# Altium schematic sheet Schemtaic Sheet 1.SchDoc
size A4; SheetNumber: 4; SheetTotal: 3
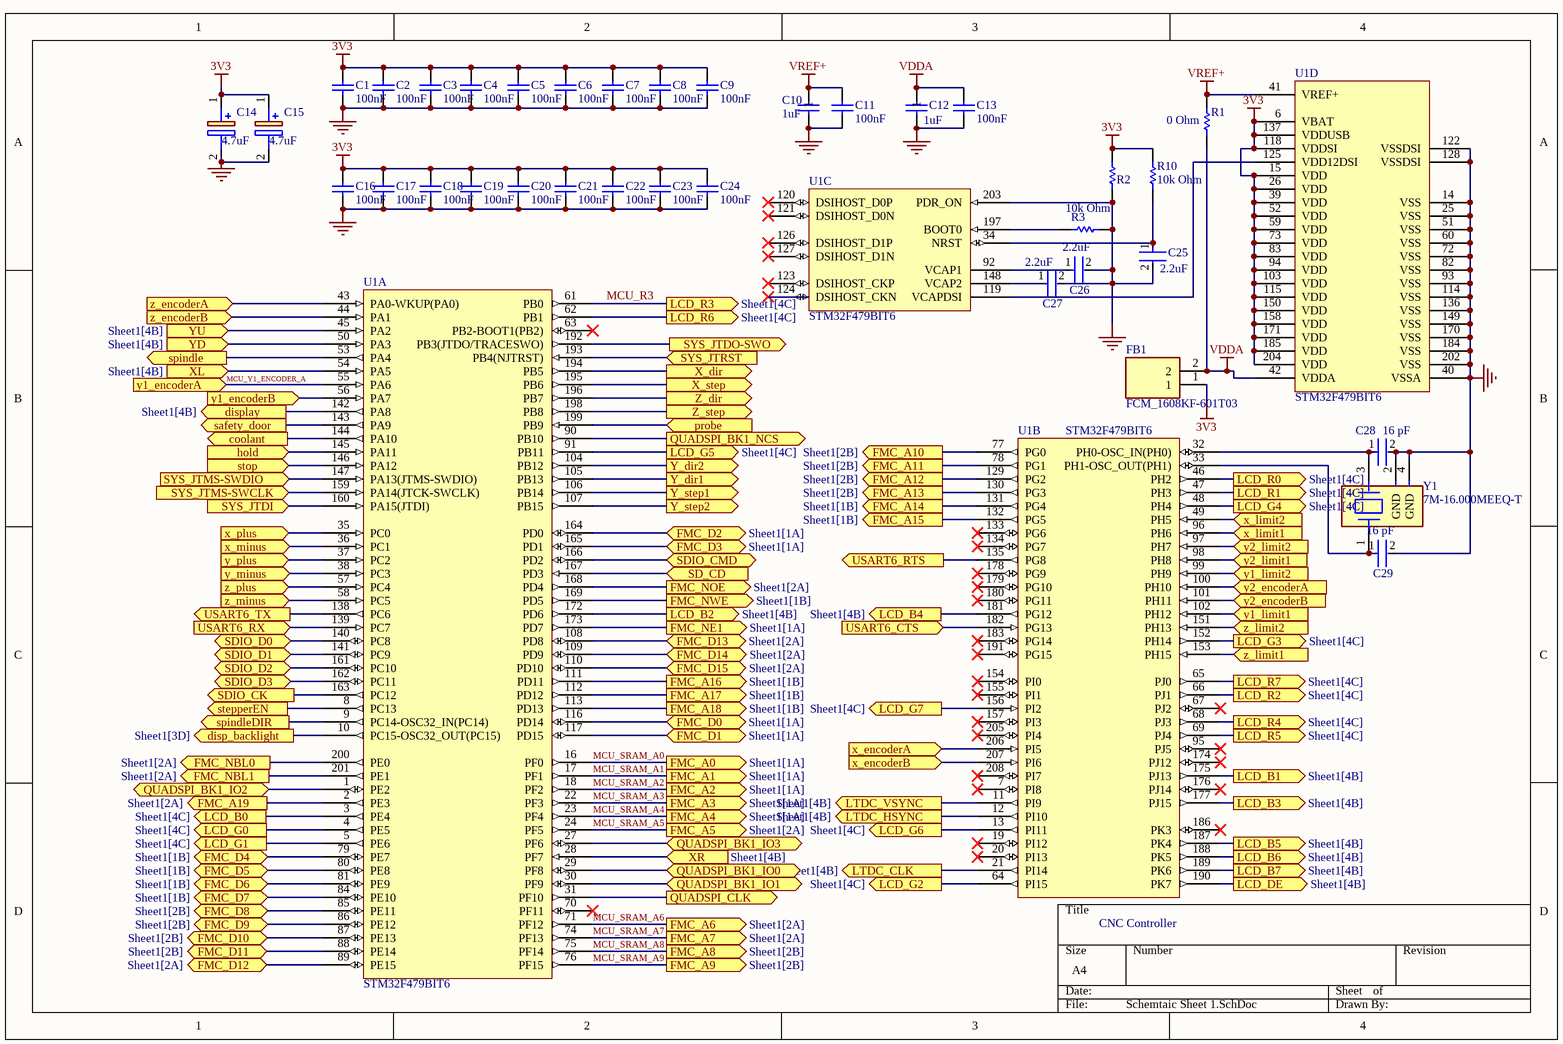
[diagram p0: Schemtaic Sheet 1.SchDoc]

## Parts
C1  Capacitance: 100nF  [CAPC1050X55X23ML05T13]  (hidden comment: CL05B104KO5NNNC)
C2  Capacitance: 100nF  [CAPC1050X55X23ML05T13]  (hidden comment: CL05B104KO5NNNC)
C3  Capacitance: 100nF  [CAPC1050X55X23ML05T13]  (hidden comment: CL05B104KO5NNNC)
C4  Capacitance: 100nF  [CAPC1050X55X23ML05T13]  (hidden comment: CL05B104KO5NNNC)
C5  Capacitance: 100nF  [CAPC1050X55X23ML05T13]  (hidden comment: CL05B104KO5NNNC)
C6  Capacitance: 100nF  [CAPC1050X55X23ML05T13]  (hidden comment: CL05B104KO5NNNC)
C7  Capacitance: 100nF  [CAPC1050X55X23ML05T13]  (hidden comment: CL05B104KO5NNNC)
C8  Capacitance: 100nF  [CAPC1050X55X23ML05T13]  (hidden comment: CL05B104KO5NNNC)
C9  Capacitance: 100nF  [CAPC1050X55X23ML05T13]  (hidden comment: CL05B104KO5NNNC)
C10  Capacitance: 1uF  [CAPC1609X100X15LL20]  (hidden comment: TACL105K016XTA)
C11  Capacitance: 100nF  [CAPC1050X55X23ML05T13]  (hidden comment: CL05B104KO5NNNC)
C12  Capacitance: 1uF  [CAPC1609X100X15LL20]  (hidden comment: TACL105K016XTA)
C13  Capacitance: 100nF  [CAPC1050X55X23ML05T13]  (hidden comment: CL05B104KO5NNNC)
C14  Capacitance: 4.7uF  [CAPPM169X100N]  (hidden comment: F981C475MMAAJ6)
C15  Capacitance: 4.7uF  [CAPPM169X100N]  (hidden comment: F981C475MMAAJ6)
C16  Capacitance: 100nF  [CAPC1050X55X23ML05T13]  (hidden comment: CL05B104KO5NNNC)
C17  Capacitance: 100nF  [CAPC1050X55X23ML05T13]  (hidden comment: CL05B104KO5NNNC)
C18  Capacitance: 100nF  [CAPC1050X55X23ML05T13]  (hidden comment: CL05B104KO5NNNC)
C19  Capacitance: 100nF  [CAPC1050X55X23ML05T13]  (hidden comment: CL05B104KO5NNNC)
C20  Capacitance: 100nF  [CAPC1050X55X23ML05T13]  (hidden comment: CL05B104KO5NNNC)
C21  Capacitance: 100nF  [CAPC1050X55X23ML05T13]  (hidden comment: CL05B104KO5NNNC)
C22  Capacitance: 100nF  [CAPC1050X55X23ML05T13]  (hidden comment: CL05B104KO5NNNC)
C23  Capacitance: 100nF  [CAPC1050X55X23ML05T13]  (hidden comment: CL05B104KO5NNNC)
C24  Capacitance: 100nF  [CAPC1050X55X23ML05T13]  (hidden comment: CL05B104KO5NNNC)
C25  Capacitance: 2.2uF  [FP-0603-L_1_6_0_15-W_0_81-IPC_C]  (hidden comment: 0603YC225KAT2A)
C26  Capacitance: 2.2uF  [FP-0603-L_1_6_0_15-W_0_81-IPC_C]  (hidden comment: 0603YC225KAT2A)
C27  Capacitance: 2.2uF  [FP-0603-L_1_6_0_15-W_0_81-IPC_C]  (hidden comment: 0603YC225KAT2A)
C28  Capacitance: 16 pF  [FP-C0402-BB-MFG]  (hidden comment: C0402C160F4HACTU)
C29  value 16 pF  [FP-C0402-BB-MFG]  (hidden comment: C0402C160F4HACTU)
FB1  FCM_1608KF-601T03  [BEADC1608X95N]
R1  Resistance: 0 Ohm  [RESC1005X40X25ML05T10]  (hidden comment: CRCW04020000Z0EDHP)
R2  CRCW040210K0FKEDHP  [RESC1005X40X25ML05T10]  (value not drawn)
R3  Resistance: 10k Ohm  [RESC1005X40X25ML05T10]  (hidden comment: CRCW040210K0FKEDHP)
R10  Resistance: 10k Ohm  [RESC1005X40X25ML05T10]  (hidden comment: CRCW040210K0FKEDHP)
U1  STM32F479BIT6  [STM-LQFP208_L]  (parts A,B,C,D of 4)
Y1  7M-16.000MEEQ-T  [FP-7M-MFG]

## Ports
coolant (out), disp_backlight (out, see Sheet1[3D]), display (out, see Sheet1[4B]), FMC_A0 (out, see Sheet1[1A]), FMC_A1 (out, see Sheet1[1A]), FMC_A2 (out, see Sheet1[1A]), FMC_A3 (out, see Sheet1[1A]), FMC_A4 (out, see Sheet1[1A]), FMC_A5 (out, see Sheet1[2A]), FMC_A6 (out, see Sheet1[2A]), FMC_A7 (out, see Sheet1[2A]), FMC_A8 (out, see Sheet1[2B]), FMC_A9 (out, see Sheet1[2B]), FMC_A10 (out, see Sheet1[2B]), FMC_A11 (out, see Sheet1[2B]), FMC_A12 (out, see Sheet1[2B]), FMC_A13 (out, see Sheet1[2B]), FMC_A14 (out, see Sheet1[1B]), FMC_A15 (out, see Sheet1[1B]), FMC_A16 (out, see Sheet1[1B]), FMC_A17 (out, see Sheet1[1B]), FMC_A18 (out, see Sheet1[1B]), FMC_A19 (out, see Sheet1[2A]), FMC_D0 (bidir, see Sheet1[1A]), FMC_D1 (bidir, see Sheet1[1A]), FMC_D2 (bidir, see Sheet1[1A]), FMC_D3 (bidir, see Sheet1[1A]), FMC_D4 (bidir, see Sheet1[1B]), FMC_D5 (bidir, see Sheet1[1B]), FMC_D6 (bidir, see Sheet1[1B]), FMC_D7 (bidir, see Sheet1[1B]), FMC_D8 (bidir, see Sheet1[2B]), FMC_D9 (bidir, see Sheet1[2B]), FMC_D10 (bidir, see Sheet1[2B]), FMC_D11 (bidir, see Sheet1[2B]), FMC_D12 (bidir, see Sheet1[2A]), FMC_D13 (bidir, see Sheet1[2A]), FMC_D14 (bidir, see Sheet1[2A]), FMC_D15 (bidir, see Sheet1[2A]), FMC_NBL0 (out, see Sheet1[2A]), FMC_NBL1 (out, see Sheet1[2A]), FMC_NE1 (out, see Sheet1[1A]), FMC_NOE (out, see Sheet1[2A]), FMC_NWE (out, see Sheet1[1B]), hold (in), LCD_B0 (out, see Sheet1[4C]), LCD_B1 (out, see Sheet1[4B]), LCD_B2 (out, see Sheet1[4B]), LCD_B3 (out, see Sheet1[4B]), LCD_B4 (out, see Sheet1[4B]), LCD_B5 (out, see Sheet1[4B]), LCD_B6 (out, see Sheet1[4B]), LCD_B7 (out, see Sheet1[4B]), LCD_DE (out, see Sheet1[4B]), LCD_G0 (out, see Sheet1[4C]), LCD_G1 (out, see Sheet1[4C]), LCD_G2 (out, see Sheet1[4C]), LCD_G3 (out, see Sheet1[4C]), LCD_G4 (out, see Sheet1[4C]), LCD_G5 (out, see Sheet1[4C]), LCD_G6 (out, see Sheet1[4C]), LCD_G7 (out, see Sheet1[4C]), LCD_R0 (out, see Sheet1[4C]), LCD_R1 (out, see Sheet1[4C]), LCD_R2 (out, see Sheet1[4C]), LCD_R3 (out, see Sheet1[4C]), LCD_R4 (out, see Sheet1[4C]), LCD_R5 (out, see Sheet1[4C]), LCD_R6 (out, see Sheet1[4C]), LCD_R7 (out, see Sheet1[4C]), LTDC_CLK (out, see Sheet1[4B]), LTDC_HSYNC (out, see Sheet1[4B]), LTDC_VSYNC (out, see Sheet1[4B]), probe (in), QUADSPI_BK1_IO0 (bidir), QUADSPI_BK1_IO1 (bidir), QUADSPI_BK1_IO2 (bidir), QUADSPI_BK1_IO3 (bidir), QUADSPI_BK1_NCS (out), QUADSPI_CLK (out), safety_door (out), SD_CD (in), SDIO_CK (out), SDIO_CMD (bidir), SDIO_D0 (bidir), SDIO_D1 (bidir), SDIO_D2 (bidir), SDIO_D3 (bidir), spindle (out), spindleDIR (out), stepperEN (out), stop (in), SYS_JTDI (in), SYS_JTDO-SWO (out), SYS_JTMS-SWCLK (in), SYS_JTMS-SWDIO (in), SYS_JTRST (in), USART6_CTS (in), USART6_RTS (out), USART6_RX (in), USART6_TX (out), X_dir (out), x_encoderA (in), x_encoderB (in), x_limit1 (in), x_limit2 (in), x_minus (in), x_plus (in), X_step (out), XL (in, see Sheet1[4B]), XR (in, see Sheet1[4B]), y1_encoderA (in), y1_encoderB (in), y1_limit1 (in), y1_limit2 (in), y2_encoderA (in), y2_encoderB (in), y2_limit1 (in), y2_limit2 (in), Y_dir1 (out), Y_dir2 (out), y_minus (in), y_plus (in), Y_step1 (out), Y_step2 (out), YD (in, see Sheet1[4B]), YU (in, see Sheet1[4B]), Z_dir (out), z_encoderA (in), z_encoderB (in), z_limit1 (in), z_limit2 (in), z_minus (in), z_plus (in), Z_step (out)

## Nets
3V3: C1.2 C2.2 C3.2 C4.2 C5.2 C6.2 C7.2 C8.2 C9.2 C14.1(+) C15.1(+) C16.2 C17.2 C18.2 C19.2 C20.2 C21.2 C22.2 C23.2 C24.2 FB1.1 R2.2 R10.2 U1.6(VBAT) U1.15(VDD) U1.26(VDD) U1.39(VDD) U1.52(VDD) U1.59(VDD) U1.73(VDD) U1.83(VDD) U1.94(VDD) U1.103(VDD) U1.115(VDD) U1.118(VDDSI) U1.137(VDDUSB) U1.150(VDD) U1.158(VDD) U1.171(VDD) U1.185(VDD) U1.204(VDD)
GND: C1.1 C2.1 C3.1 C4.1 C5.1 C6.1 C7.1 C8.1 C9.1 C10.1 C11.1 C12.1 C13.1 C14.2(-) C15.2(-) C16.1 C17.1 C18.1 C19.1 C20.1 C21.1 C22.1 C23.1 C24.1 C25.2 C26.2 C27.2 C28.2 C29.2 R2.1 R3.2 U1.14(VSS) U1.25(VSS) U1.40(VSSA) U1.51(VSS) U1.60(VSS) U1.72(VSS) U1.82(VSS) U1.93(VSS) U1.114(VSS) U1.122(VSSDSI) U1.128(VSSDSI) U1.136(VSS) U1.149(VSS) U1.170(VSS) U1.184(VSS) U1.202(VSS) U1.203(PDR_ON) Y1.2(GND) Y1.4(GND)
VDDA: C12.2 C13.2 FB1.2 R1.1 U1.42(VDDA)
VREF+: C10.2 C11.2 R1.2 U1.41(VREF+)
coolant: U1.144(PA10) ; port coolant
disp_backlight: U1.10(PC15-OSC32_OUT(PC15)) ; port disp_backlight
display: U1.142(PA8) ; port display
FMC_A10: U1.77(PG0) ; port FMC_A10
FMC_A11: U1.78(PG1) ; port FMC_A11
FMC_A12: U1.129(PG2) ; port FMC_A12
FMC_A13: U1.130(PG3) ; port FMC_A13
FMC_A14: U1.131(PG4) ; port FMC_A14
FMC_A15: U1.132(PG5) ; port FMC_A15
FMC_A16: U1.111(PD11) ; port FMC_A16
FMC_A17: U1.112(PD12) ; port FMC_A17
FMC_A18: U1.113(PD13) ; port FMC_A18
FMC_A19: U1.2(PE3) ; port FMC_A19
FMC_D0: U1.116(PD14) ; port FMC_D0
FMC_D1: U1.117(PD15) ; port FMC_D1
FMC_D2: U1.164(PD0) ; port FMC_D2
FMC_D3: U1.165(PD1) ; port FMC_D3
FMC_D4: U1.79(PE7) ; port FMC_D4
FMC_D5: U1.80(PE8) ; port FMC_D5
FMC_D6: U1.81(PE9) ; port FMC_D6
FMC_D7: U1.84(PE10) ; port FMC_D7
FMC_D8: U1.85(PE11) ; port FMC_D8
FMC_D9: U1.86(PE12) ; port FMC_D9
FMC_D10: U1.87(PE13) ; port FMC_D10
FMC_D11: U1.88(PE14) ; port FMC_D11
FMC_D12: U1.89(PE15) ; port FMC_D12
FMC_D13: U1.108(PD8) ; port FMC_D13
FMC_D14: U1.109(PD9) ; port FMC_D14
FMC_D15: U1.110(PD10) ; port FMC_D15
FMC_NBL0: U1.200(PE0) ; port FMC_NBL0
FMC_NBL1: U1.201(PE1) ; port FMC_NBL1
FMC_NE1: U1.173(PD7) ; port FMC_NE1
FMC_NOE: U1.168(PD4) ; port FMC_NOE
FMC_NWE: U1.169(PD5) ; port FMC_NWE
hold: U1.145(PA11) ; port hold
LCD_B0: U1.3(PE4) ; port LCD_B0
LCD_B1: U1.175(PJ13) ; port LCD_B1
LCD_B2: U1.172(PD6) ; port LCD_B2
LCD_B3: U1.177(PJ15) ; port LCD_B3
LCD_B4: U1.181(PG12) ; port LCD_B4
LCD_B5: U1.187(PK4) ; port LCD_B5
LCD_B6: U1.188(PK5) ; port LCD_B6
LCD_B7: U1.189(PK6) ; port LCD_B7
LCD_DE: U1.190(PK7) ; port LCD_DE
LCD_G0: U1.4(PE5) ; port LCD_G0
LCD_G1: U1.5(PE6) ; port LCD_G1
LCD_G2: U1.64(PI15) ; port LCD_G2
LCD_G3: U1.152(PH14) ; port LCD_G3
LCD_G4: U1.48(PH4) ; port LCD_G4
LCD_G5: U1.91(PB11) ; port LCD_G5
LCD_G6: U1.13(PI11) ; port LCD_G6
LCD_G7: U1.156(PI2) ; port LCD_G7
LCD_R0: U1.46(PH2) ; port LCD_R0
LCD_R1: U1.47(PH3) ; port LCD_R1
LCD_R2: U1.66(PJ1) ; port LCD_R2
LCD_R4: U1.68(PJ3) ; port LCD_R4
LCD_R5: U1.69(PJ4) ; port LCD_R5
LCD_R6: U1.62(PB1) ; port LCD_R6
LCD_R7: U1.65(PJ0) ; port LCD_R7
LTDC_CLK: U1.21(PI14) ; port LTDC_CLK
LTDC_HSYNC: U1.12(PI10) ; port LTDC_HSYNC
LTDC_VSYNC: U1.11(PI9) ; port LTDC_VSYNC
MCU_R3: U1.61(PB0) ; port LCD_R3
MCU_SRAM_A0: U1.16(PF0) ; port FMC_A0
MCU_SRAM_A1: U1.17(PF1) ; port FMC_A1
MCU_SRAM_A2: U1.18(PF2) ; port FMC_A2
MCU_SRAM_A3: U1.22(PF3) ; port FMC_A3
MCU_SRAM_A4: U1.23(PF4) ; port FMC_A4
MCU_SRAM_A5: U1.24(PF5) ; port FMC_A5
MCU_SRAM_A6: U1.71(PF12) ; port FMC_A6
MCU_SRAM_A7: U1.74(PF13) ; port FMC_A7
MCU_SRAM_A8: U1.75(PF14) ; port FMC_A8
MCU_SRAM_A9: U1.76(PF15) ; port FMC_A9
MCU_Y1_ENCODER_A: U1.55(PA6) ; port y1_encoderA
probe: U1.199(PB9) ; port probe
QUADSPI_BK1_IO0: U1.29(PF8) ; port QUADSPI_BK1_IO0
QUADSPI_BK1_IO1: U1.30(PF9) ; port QUADSPI_BK1_IO1
QUADSPI_BK1_IO2: U1.1(PE2) ; port QUADSPI_BK1_IO2
QUADSPI_BK1_IO3: U1.27(PF6) ; port QUADSPI_BK1_IO3
QUADSPI_BK1_NCS: U1.90(PB10) ; port QUADSPI_BK1_NCS
QUADSPI_CLK: U1.31(PF10) ; port QUADSPI_CLK
safety_door: U1.143(PA9) ; port safety_door
SD_CD: U1.167(PD3) ; port SD_CD
SDIO_CK: U1.163(PC12) ; port SDIO_CK
SDIO_CMD: U1.166(PD2) ; port SDIO_CMD
SDIO_D0: U1.140(PC8) ; port SDIO_D0
SDIO_D1: U1.141(PC9) ; port SDIO_D1
SDIO_D2: U1.161(PC10) ; port SDIO_D2
SDIO_D3: U1.162(PC11) ; port SDIO_D3
spindle: U1.53(PA4) ; port spindle
spindleDIR: U1.9(PC14-OSC32_IN(PC14)) ; port spindleDIR
stepperEN: U1.8(PC13) ; port stepperEN
stop: U1.146(PA12) ; port stop
SYS_JTDI: U1.160(PA15(JTDI)) ; port SYS_JTDI
SYS_JTDO-SWO: U1.192(PB3(JTDO/TRACESWO)) ; port SYS_JTDO-SWO
SYS_JTMS-SWCLK: U1.159(PA14(JTCK-SWCLK)) ; port SYS_JTMS-SWCLK
SYS_JTMS-SWDIO: U1.147(PA13(JTMS-SWDIO)) ; port SYS_JTMS-SWDIO
SYS_JTRST: U1.193(PB4(NJTRST)) ; port SYS_JTRST
USART6_CTS: U1.182(PG13) ; port USART6_CTS
USART6_RTS: U1.135(PG8) ; port USART6_RTS
USART6_RX: U1.139(PC7) ; port USART6_RX
USART6_TX: U1.138(PC6) ; port USART6_TX
X_dir: U1.194(PB5) ; port X_dir
x_encoderA: U1.206(PI5) ; port x_encoderA
x_encoderB: U1.207(PI6) ; port x_encoderB
x_limit1: U1.96(PH6) ; port x_limit1
x_limit2: U1.49(PH5) ; port x_limit2
x_minus: U1.36(PC1) ; port x_minus
x_plus: U1.35(PC0) ; port x_plus
X_step: U1.195(PB6) ; port X_step
XL: U1.54(PA5) ; port XL
XR: U1.28(PF7) ; port XR
y1_encoderB: U1.56(PA7) ; port y1_encoderB
y1_limit1: U1.102(PH12) ; port y1_limit1
y1_limit2: U1.99(PH9) ; port y1_limit2
y2_encoderA: U1.100(PH10) ; port y2_encoderA
y2_encoderB: U1.101(PH11) ; port y2_encoderB
y2_limit1: U1.98(PH8) ; port y2_limit1
y2_limit2: U1.97(PH7) ; port y2_limit2
Y_dir1: U1.105(PB13) ; port Y_dir1
Y_dir2: U1.104(PB12) ; port Y_dir2
y_minus: U1.38(PC3) ; port y_minus
y_plus: U1.37(PC2) ; port y_plus
Y_step1: U1.106(PB14) ; port Y_step1
Y_step2: U1.107(PB15) ; port Y_step2
YD: U1.50(PA3) ; port YD
YU: U1.45(PA2) ; port YU
Z_dir: U1.196(PB7) ; port Z_dir
z_encoderA: U1.43(PA0-WKUP(PA0)) ; port z_encoderA
z_encoderB: U1.44(PA1) ; port z_encoderB
z_limit1: U1.153(PH15) ; port z_limit1
z_limit2: U1.151(PH13) ; port z_limit2
z_minus: U1.58(PC5) ; port z_minus
z_plus: U1.57(PC4) ; port z_plus
Z_step: U1.198(PB8) ; port Z_step
NetC25_1: C25.1 R10.1 U1.34(NRST)
NetC26_1: C26.1 U1.92(VCAP1)
NetC27_1: C27.1 U1.148(VCAP2)
NetC28_1: C28.1 U1.32(PH0-OSC_IN(PH0)) Y1.3
NetC29_1: C29.1 U1.33(PH1-OSC_OUT(PH1)) Y1.1
NetR3_1: R3.1 U1.197(BOOT0)
NetU1_119: U1.119(VCAPDSI) U1.125(VDD12DSI)

Not connected (* = marked no-connect by the designer): U1 7(PI8)* 19(PI12)* 20(PI13)* 63(PB2-BOOT1(PB2))* 67(PJ2)* 70(PF11)* 95(PJ5)* 120(DSIHOST_D0P)* 121(DSIHOST_D0N)* 123(DSIHOST_CKP)* 124(DSIHOST_CKN)* 126(DSIHOST_D1P)* 127(DSIHOST_D1N)* 133(PG6)* 134(PG7)* 154(PI0)* 155(PI1)* 157(PI3)* 174(PJ12)* 176(PJ14)* 178(PG9)* 179(PG10)* 180(PG11)* 183(PG14)* 186(PK3)* 191(PG15)* 205(PI4)* 208(PI7)*

## Notes on the sheet
- (near U1) CNC Controller

## Library data of the parts
C1-C9 C11 C13 C16-C24 = CMP-2000-05439-1: Chip Capacitor, 100 nF, +/- 10%, 16 V, -55 to 125 degC, 0402 (1005 Metric), RoHS, Tape and Reel; Manufacturer: Samsung Electro-Mechanics; Dielectric: X7R; Rated Voltage: 16V; Case Size/Dimension: 0402; Tolerance (%): ±10%; Manufacturer URL: http://www.samsungsem.com/global/index.jsp; Datasheet URL: https://datasheet.ciiva.com/29198/458718-da-01-en-vs-kondensator-0402-29198423.pdf; Datasheet Version: Nov-10
C10 C12 = CMP-2006-00185-1: Manufacturer: AVX Interconnect / Elco; Part Number: TACL105K016XTA
C14 C15 = F981C475MMAAJ6: Capacitor Polarised; Manufacturer_Name: AVX; Datasheet Link: https://gr.mouser.com/datasheet/2/40/F98_AJ6-1853402.pdf; Height: 1mm; Manufacturer_Part_Number: F981C475MMAAJ6; Mouser Part Number: 581-F981C475MMAAJ6; Mouser Price/Stock: https://www.mouser.co.uk/ProductDetail/AVX/F981C475MMAAJ6?qs=TiOZkKH1s2RaZvKvTPf7rg%3D%3D
C25-C27 = CMP-04427-012083-1: General Purpose Ceramic Capacitor, 0603, 2.2uF, 10%, X7R, 15%, 16V; Case/Package: 0603; Dielectric: X7R; Tolerance: 10%; Voltage Rating (DC): 16V; RoHS Compliant: Yes
C28 = CMP-03020-017899-1: C0402 16 pF X8R 1.00% 16 V; Manufacturer: Kemet; Temperature Coefficient: 15%; Voltage Rating: 16 V; Material: Ceramic; Tolerance: 0.01; Value: 16 pF; Height: 0.55mm; RoHS: TRUE; Lead Free: Yes; Temperature Characteristic: X8R; Temperature Range Low: -55°C; Ipc Land Pattern Name: CAPC10050X50; Device Class L3: Ceramic Capacitors; Temperature: -55°C to +125°C; Device Class L2: Capacitors; Temperature Range High: +125°C; Package: C0402-BB; Manufacturer Part Number: C0402C160F4HACTU; ComponentLink2URL: https://content.kemet.com/datasheets/KEM_C1002_X7R_SMD.pdf; Automotive: No; ComponentLink2Description: Datasheet; Octopart: https://octopart.com/c0402c160f4hactu-kemet-88724207; Device Class L1: Passive Components; Category: Cap
C29 = CMP-03020-017899-1: C0402 16 pF X8R 1.00% 16 V; Manufacturer: Kemet; Temperature Coefficient: 15%; Voltage Rating: 16 V; Material: Ceramic; Tolerance: 0.01; Height: 0.55mm; RoHS: TRUE; Lead Free: Yes; Temperature Characteristic: X8R; Temperature Range Low: -55°C; Ipc Land Pattern Name: CAPC10050X50; Device Class L3: Ceramic Capacitors; Temperature: -55°C to +125°C; Device Class L2: Capacitors; Temperature Range High: +125°C; Package: C0402-BB; Manufacturer Part Number: C0402C160F4HACTU; ComponentLink2URL: https://content.kemet.com/datasheets/KEM_C1002_X7R_SMD.pdf; Automotive: No; Capacitance: 16 pF; ComponentLink2Description: Datasheet; Octopart: https://octopart.com/c0402c160f4hactu-kemet-88724207; Device Class L1: Passive Components; Category: Cap
FB1 = FCM_1608KF-601T03: Ferrite Bead; Manufacturer_Name: TAI-TECH; Manufacturer_Part_Number: FCM 1608KF-601T03; Datasheet Link: https://www.tai-tech.com.tw/_upload/files/Specification/general/FCM1608-Series.pdf; Height: 0.95mm
R1 = CMP-2002-03041-1: Manufacturer: Vishay Dale; Part Number: CRCW04020000Z0EDHP
R2 R3 R10 = CMP-2002-03043-1: Manufacturer: Vishay Dale; Part Number: CRCW040210K0FKEDHP
U1 = CMP-0243-00247-1: ARM Cortex-M4 32-bit MCU+FPU, 2048 KB Flash, 384 KB Internal RAM, 161 I/Os, 208-Pin LQFP, -40 to 85 degC, Tray; Operating Frequency(F) (Processor speed) (MHz): 180; Supply Voltage(Vcc) min (V): 1.7; I/Os (High Current): 161; Internal RAM Size (kB): 384; FLASH Size (Prog) (kB): 2048; D/A Converter: 2; DatasheetVersion: Rev. 4; Package Description: LQFP-208; ComponentLink2URL: http://www.st.com/st-web-ui/static/active/en/resource/technical/document/datasheet/DM00208574.pdf; Package Reference: 208-Pin Low Profile Quad Flat Package, 28 x 28 mm Body, 0.5 mm Pitch; Packing: Tray; ComponentLink1Description: Manufacturer URL; Core: ARM Cortex-M4; ComponentLink1URL: http://www.st.com/; Mounting Technology: Surface Mount; ComponentLink2Description: Datasheet
Y1 = CMP-18717-000438-1: Crystal 16MHz, 10ppm, 10pF, 60Ω; ESR (Equivalent Series Resistance): 100R; Width: 2.5mm; REACH SVHC: No SVHC; Mount: Surface Mount; Package Quantity: 1; Depth: 2.5mm; Frequency Tolerance: 10ppm; Length: 3.2mm; Packaging: Tape and Reel; Termination: SMD/SMT; RoHS Compliant: Yes; Max Operating Temperature: 70°C; Min Operating Temperature: -10°C; Tolerance: 10ppm; Frequency Stability: 10ppm; Series: 7M; Height: 0.031inch; Number of Pins: 4; Load Capacitance: 10pF; Frequency: 16MHz; Case/Package: SMD/SMT